# EAGLE design tinyK20 (EAGLE 6.4)
DRAWN_BY: Christian Jost; PROJECT: Infotronik; REV: 1.2; TITLE: ucBoard K20
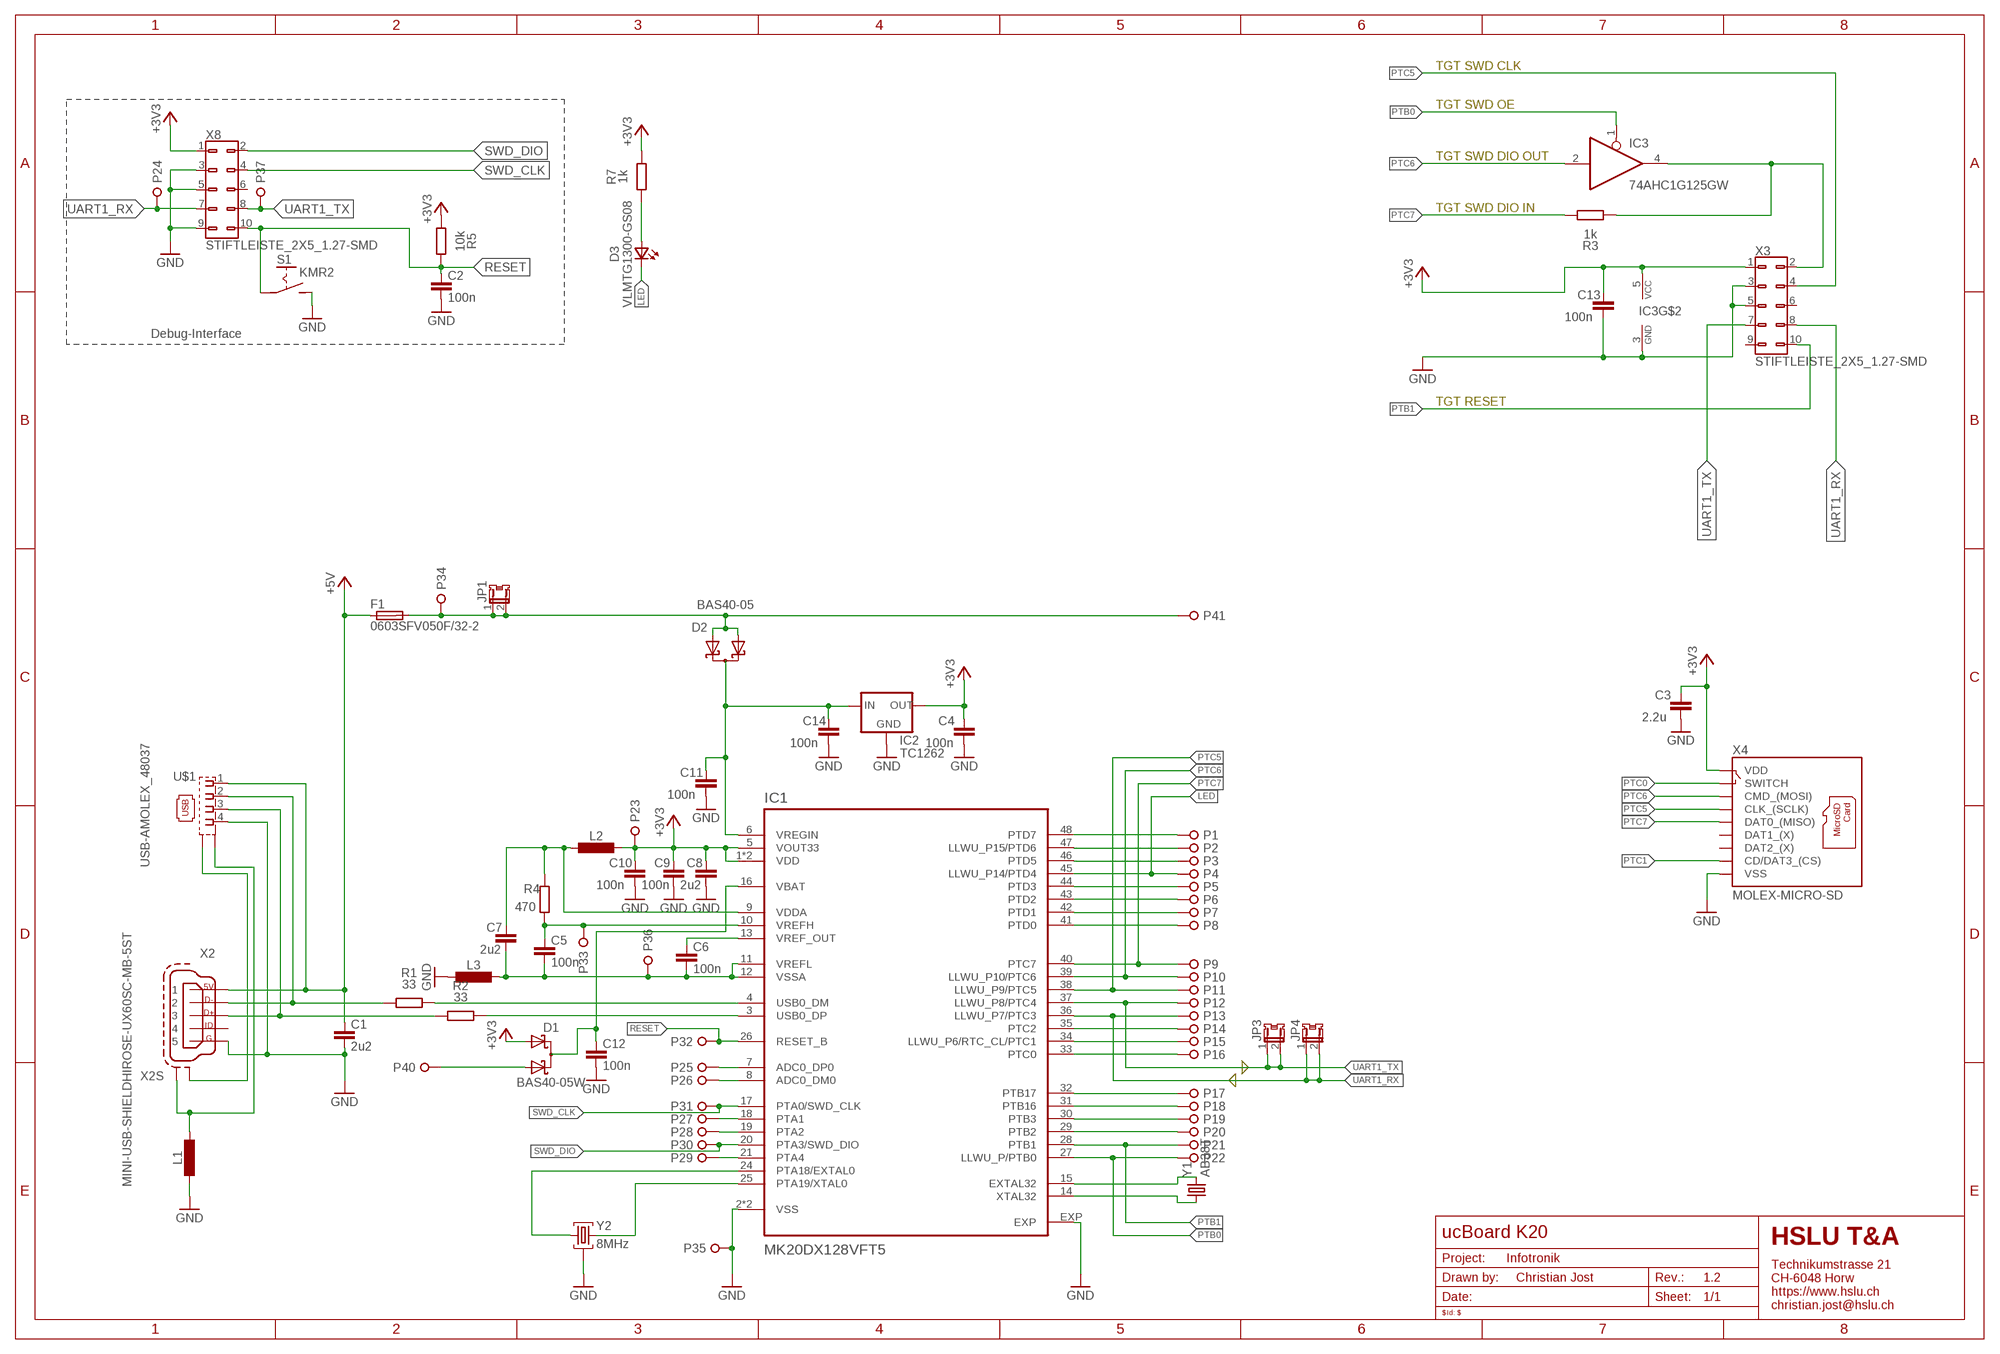
[diagram p0: schematic, sheet 1]

## Parts
C1  2u2  C0603  [C0603-R]
C2  100n  C0603  [C0603-R]
C3  2.2u  C0603  [C0603-R]
C4  100n  C0603  [C0603-R]
C5  100n  C0603  [C0603-R]
C6  100n  C0603  [C0603-R]
C7  2u2  C0603  [C0603-R]
C8  2u2  C0603  [C0603-R]
C9  100n  C0603  [C0603-R]
C10  100n  C0603  [C0603-R]
C11  100n  C0603  [C0603-R]
C12  100n  C0603  [C0603-R]
C13  100n  C0603  [C0603-R]
C14  100n  C0603  [C0603-R]
D1  BAS40-05W  [SOT-323]
D2  BAS40-05  [SOT-23]
D3  VLMTG1300-GS08  [D0603-R]
F1  0603SFV050F/32-2  [0603-R]
IC1  MK20DX128VFT5  [QFN48]
IC2  TC1262  [SOT-223]
IC3  74AHC1G125GW  [SOT-353]
JP1  JP1-SMD-1.2X1.8  [JP-SMD-1.2X1.8]
JP3  JP1-SMD-1.2X1.8  [JP-SMD-1.2X1.8]
JP4  JP1-SMD-1.2X1.8  [JP-SMD-1.2X1.8]
L1  L  [L0603-R]
L2  L  [L0603-R]
L3  L  [L0603-R]
P1  SOLDERPAD  [SOLDERPAD_TH_0.9]
P2  SOLDERPAD  [SOLDERPAD_TH_0.9]
P3  SOLDERPAD  [SOLDERPAD_TH_0.9]
P4  SOLDERPAD  [SOLDERPAD_TH_0.9]
P5  SOLDERPAD  [SOLDERPAD_TH_0.9]
P6  SOLDERPAD  [SOLDERPAD_TH_0.9]
P7  SOLDERPAD  [SOLDERPAD_TH_0.9]
P8  SOLDERPAD  [SOLDERPAD_TH_0.9]
P9  SOLDERPAD  [SOLDERPAD_TH_0.9]
P10  SOLDERPAD  [SOLDERPAD_TH_0.9]
P11  SOLDERPAD  [SOLDERPAD_TH_0.9]
P12  SOLDERPAD  [SOLDERPAD_TH_0.9]
P13  SOLDERPAD  [SOLDERPAD_TH_0.9]
P14  SOLDERPAD  [SOLDERPAD_TH_0.9]
P15  SOLDERPAD  [SOLDERPAD_TH_0.9]
P16  SOLDERPAD  [SOLDERPAD_TH_0.9]
P17  SOLDERPAD  [SOLDERPAD_TH_0.9]
P18  SOLDERPAD  [SOLDERPAD_TH_0.9]
P19  SOLDERPAD  [SOLDERPAD_TH_0.9]
P20  SOLDERPAD  [SOLDERPAD_TH_0.9]
P21  SOLDERPAD  [SOLDERPAD_TH_0.9]
P22  SOLDERPAD  [SOLDERPAD_TH_0.9]
P23  SOLDERPAD  [SOLDERPAD_TH_0.9]
P24  SOLDERPAD  [SOLDERPAD_TH_0.9]
P25  SOLDERPAD  [SOLDERPAD_TH_0.9]
P26  SOLDERPAD  [SOLDERPAD_TH_0.9]
P27  SOLDERPAD  [SOLDERPAD_TH_0.9]
P28  SOLDERPAD  [SOLDERPAD_TH_0.9]
P29  SOLDERPAD  [SOLDERPAD_TH_0.9]
P30  SOLDERPAD  [SOLDERPAD_TH_0.9]
P31  SOLDERPAD  [SOLDERPAD_TH_0.9]
P32  SOLDERPAD  [SOLDERPAD_TH_0.9]
P33  SOLDERPAD  [SOLDERPAD_TH_0.9]
P34  SOLDERPAD  [SOLDERPAD_TH_0.9]
P35  SOLDERPAD  [SOLDERPAD_TH_0.9]
P36  SOLDERPAD  [SOLDERPAD_TH_0.9]
P37  SOLDERPAD  [SOLDERPAD_TH_0.9]
P40  SOLDERPAD  [SOLDERPAD_TH_0.9]
P41  SOLDERPAD  [SOLDERPAD_TH_0.9]
R1  33  R0603  [R0603-R]
R2  33  R0603  [R0603-R]
R3  1k  R0603  [R0603-R]
R4  470  R0603  [R0603-R]
R5  10k  R0603  [R0603-R]
R7  1k  R0603  [R0603-R]
S1  KMR2  KMR211G-LFS  [SWITCH-KMR-SERIES]
U$1  USB-AMOLEX_48037  [USB-A-MOLEX_48037]
X2  MINI-USB-SHIELDHIROSE-UX60SC-MB-5ST  [USB-MINI-B-HORIZ_HIROSE-UX60SC-MB-5ST]
X3  STIFTLEISTE_2X5_1.27-SMD  [STIFTLEISTE_2X5_1.27_SMD]
X4  MOLEX-MICRO-SD  [SD-105027-001]
X8  STIFTLEISTE_2X5_1.27-SMD  [STIFTLEISTE_2X5_1.27_SMD]
Y1  AB38T  [CRYSTAL-AB38T]
Y2  8MHz  CSTCE8M00G15C  [CSTCE]

## Nets
+3V3: C3.1 C4.1 C8.1 C9.1 C10.1 C13.1 D1.1 IC1.1(VDD) IC1.5(VOUT33) IC1.22(VDD) IC2.3(OUT) IC3.5(VCC) L2.2 P23.1(PAD) R5.1 R7.2 X3.1 X4.P4(VDD) X8.1
+5V: C1.1 F1.1 U$1.1 X2.1
GND: C1.2 C2.2 C3.2 C4.2 C8.2 C9.2 C10.2 C11.2 C12.2 C13.2 C14.2 IC1.2(VSS) IC1.23(VSS) IC1.EXP IC2.2(GND) IC2.4(GND) IC3.3(GND) L1.1 L3.1 P35.1(PAD) S1.3(S) S1.4(S) U$1.4 X2.5 X3.3 X3.5 X4.P6(VSS) X8.3 X8.5 X8.9 Y2.2
LED: D3.2(K) IC1.45(LLWU_P14/PTD4) P4.1(PAD)
N$1: R1.1 U$1.2 X2.2
N$2: D1.2 P40.1(PAD)
N$3: C5.2 C6.2 C7.2 IC1.11(VREFL) IC1.12(VSSA) L3.2 P36.1(PAD)
N$4: R2.1 U$1.3 X2.3
N$5: C6.1 IC1.13(VREF_OUT)
N$6: IC1.4(USB0_DM) R1.2
N$7: C5.1 IC1.10(VREFH) P33.1(PAD) R4.1
N$8: IC1.3(USB0_DP) R2.2
N$9: IC1.24(PTA18/EXTAL0) Y2.1
N$10: IC1.25(PTA19/XTAL0) Y2.3
N$11: C7.1 IC1.9(VDDA) L2.1 R4.2
N$12: IC1.48(PTD7) P1.1(PAD)
N$13: IC1.47(LLWU_P15/PTD6) P2.1(PAD)
N$14: IC1.46(PTD5) P3.1(PAD)
N$15: U$1.S2A(S2) U$1.S2B(S2) X2.S1(S:S1)
N$16: C11.1 C14.1 D2.3 IC1.6(VREGIN) IC2.1(IN)
N$17: D3.1(A) R7.1
N$18: IC1.44(PTD3) P5.1(PAD)
N$19: C12.1 D1.3 IC1.16(VBAT)
N$20: IC1.43(PTD2) P6.1(PAD)
N$21: IC1.42(PTD1) P7.1(PAD)
N$23: IC1.41(PTD0) P8.1(PAD)
N$24: D2.1 D2.2 F1.2 JP1.1 JP1.2 P34.1(PAD) P41.1(PAD)
N$25: IC3.4(O) R3.1 X3.2
N$29: IC1.35(PTC2) P14.1(PAD)
N$32: IC1.32(PTB17) P17.1(PAD)
N$33: IC1.31(PTB16) P18.1(PAD)
N$34: IC1.30(PTB3) P19.1(PAD)
N$35: IC1.29(PTB2) P20.1(PAD)
N$38: IC1.15(EXTAL32) Y1.2
N$39: IC1.14(XTAL32) Y1.1
N$40: IC1.21(PTA4) P29.1(PAD)
N$41: IC1.19(PTA2) P28.1(PAD)
N$42: IC1.18(PTA1) P27.1(PAD)
N$43: IC1.8(ADC0_DM0) P26.1(PAD)
N$44: IC1.7(ADC0_DP0) P25.1(PAD)
N$46: L1.2 U$1.S1A(S1) U$1.S1B(S1) X2.S2(S:S2)
PTB0: IC1.27(LLWU_P/PTB0) IC3.1(OE) P22.1(PAD)
PTB1: IC1.28(PTB1) P21.1(PAD) X3.10
PTC0: IC1.33(PTC0) P16.1(PAD) X4.G1(SWITCH)
PTC1: IC1.34(LLWU_P6/RTC_CL/PTC1) P15.1(PAD) X4.P2(CD/DAT3_(CS))
PTC5: IC1.38(LLWU_P9/PTC5) P11.1(PAD) X3.4 X4.P5(CLK_(SCLK))
PTC6: IC1.39(LLWU_P10/PTC6) IC3.2(I) P10.1(PAD) X4.P3(CMD_(MOSI))
PTC7: IC1.40(PTC7) P9.1(PAD) R3.2 X4.P7(DAT0_(MISO))
RESET: C2.1 IC1.26(RESET_B) P32.1(PAD) R5.2 S1.1(C) S1.2(C) X8.10
SWD_CLK: IC1.17(PTA0/SWD_CLK) P31.1(PAD) X8.4
SWD_DIO: IC1.20(PTA3/SWD_DIO) P30.1(PAD) X8.2
UART1_RX: IC1.36(LLWU_P7/PTC3) JP4.1 JP4.2 P13.1(PAD) P24.1(PAD) X3.8 X8.7
UART1_TX: IC1.37(LLWU_P8/PTC4) JP3.1 JP3.2 P12.1(PAD) P37.1(PAD) X3.7 X8.8
Unconnected: X2.4 X3.6 X3.9 X4.P1(DAT2_(X)) X4.P8(DAT1_(X)) X8.6

## Notes on the sheet
- TGT SWD CLK
- TGT SWD OE
- TGT SWD DIO OUT
- TGT SWD DIO IN
- Debug-Interface
- TGT RESET

## Library data of the parts
C1-C14 = passive:C: Capacitor
D1 D2 = discreteSemiconductors:BAS40-05: Schottky Diode Common Cathode
D3 = discreteSemiconductors:VLM*: Vishay 0603 Highbright ChipLED VLMS1300 Super red VLMO1300 Soft orange VLMY1300 Yellow VLMG1300 Yellow green VLMTG1300 True green VLMB1300 Blue VLMB1310 Blue
F1 = misc:0603SFV*F/32-2: 0603 Very Fast-Acting Chip Fuses TE connectivity
IC1 = ICs:MK20D
IC2 = ICs:TC1262: 500mA Fixed Output CMOS LDO
IC3 = 74xx-little:74*1G125
JP1 JP3 JP4 = misc:JP1: JUMPER
L1-L3 = passive:L: Inductor
P1-P37 P40 P41 = connectors:SOLDERPAD
R1-R5 R7 = passive:R: Resistor
S1 = misc:KMR2*: SWITCH-KMR-SERIES KMR2xyz?LFS Operating Force x x=1 => 1.2 N x=2 => 2.0 N x=3 => 3.0 N x=5 => 4.0 N Contact material y y=1 => Silver y=2 => Silver long life y=3 => Gold Grounding option z z=G => Ground pin z=NG => No Ground pin
U$1 = connectors:USB-A
X2 = connectors:MINI-USB-SHIELD: MINI USB-B Conector; MFR: HIROSE; MFR_PART-NO: UX60SC-MB-5ST; MOUSER_PART-NO: 798-UX60SCMB5ST01
X3 X8 = connectors:STIFTLEISTE_2X5_1.27
X4 = connectors:MOLEX-MICRO-SD: Molex Micro-SD Card holder SD-105027-001
Y1 = discreteSemiconductors:AB?T
Y2 = discreteSemiconductors:CSTCE: muRata Ceramic Resonators CSTCE series

## Board
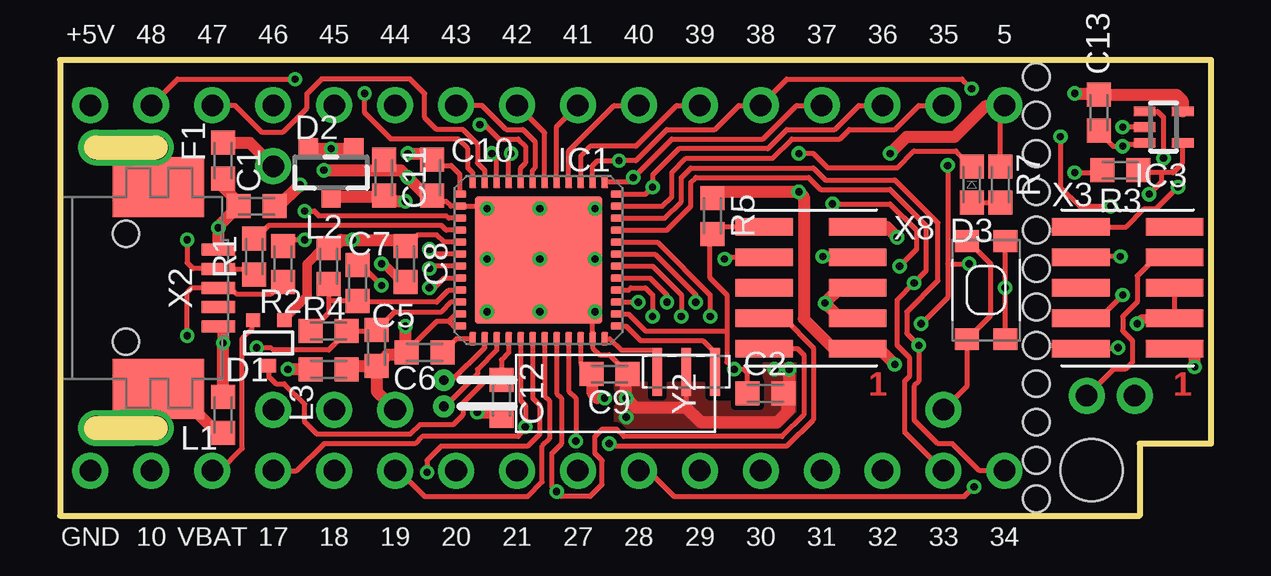
[diagram p1: board, top side]
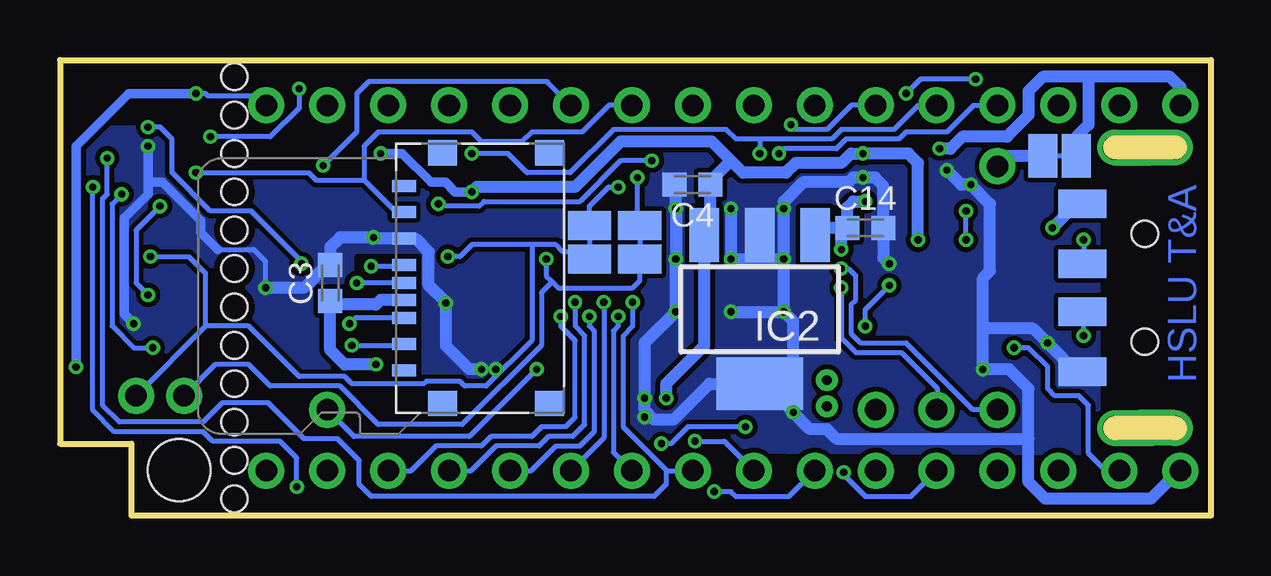
[diagram p2: board, bottom side, seen from below]

Size 47.97 x 19 mm. Coordinates in mm from the lower left corner, seen from the top.
Outline: 0,0 45,0 45,3 47.97,3 47.97,19 0,19 0,0
Copper layers (1*16): Top 0.035mm / dielectric 1.5mm / Bottom 0.035mm
Design rules "PCB-POOL Standard *": minimum track width 0.15mm, minimum drill 0.3mm, track to track 0.2mm, track to pad 0.2mm, pad to pad 0.2mm, via to via 0.2mm, smd to smd 0.15mm, copper to edge 0.3mm, drill to drill 0.2mm, minimum pad ring 0.15mm, minimum via ring 0.15mm, stop-mask expansion 0.075mm, vias tented up to drill 0.3mm, thermal gap 0.2mm
Holes 2.6 mm at 43,1.9
Holes 1.1 mm at 40.7,10.3 40.7,8.7 40.7,7.1 40.7,5.5 40.7,3.9 40.7,11.9 40.7,13.5 40.7,2.3 40.7,15.1 40.7,16.7 40.7,18.3 40.7,0.7

### Footprints (pad centres in the part's own frame; a part is rotated, then mirrored left to right if it is on the bottom)
C0603-R = smd 1 x 1: 1 -0.75,0; 2 0.75,0
SOT-323 = smd 0.6 x 0.55: 1 -0.65,-0.95; 2 0.65,-0.95; 3 0,0.95
SOT-23 = smd 0.8 x 0.9: 1 -0.95,-1; 2 0.95,-1; 3 0,1
D0603-R = smd 1 x 1: 1 -0.75,0; 2 0.75,0
0603-R = smd 1 x 1: 1 -0.75,0; 2 0.75,0
QFN48 = smd 0.55 x 0.3: 1 -3.275,2.75; 2 -3.275,2.25; 3 -3.275,1.75; 4 -3.275,1.25; 5 -3.275,0.75; 6 -3.275,0.25; 7 -3.275,-0.25; 8 -3.275,-0.75; 9 -3.275,-1.25; 10 -3.275,-1.75; 11 -3.275,-2.25; 12 -3.275,-2.75; 25 3.275,-2.75; 26 3.275,-2.25; 27 3.275,-1.75; 28 3.275,-1.25; 29 3.275,-0.75; 30 3.275,-0.25; 31 3.275,0.25; 32 3.275,0.75; 33 3.275,1.25; 34 3.275,1.75; 35 3.275,2.25; 36 3.275,2.75 | smd 0.3 x 0.55: 13 -2.75,-3.275; 14 -2.25,-3.275; 15 -1.75,-3.275; 16 -1.25,-3.275; 17 -0.75,-3.275; 18 -0.25,-3.275; 19 0.25,-3.275; 20 0.75,-3.275; 21 1.25,-3.275; 22 1.75,-3.275; 23 2.25,-3.275; 24 2.75,-3.275; 37 2.75,3.275; 38 2.25,3.275; 39 1.75,3.275; 40 1.25,3.275; 41 0.75,3.275; 42 0.25,3.275; 43 -0.25,3.275; 44 -0.75,3.275; 45 -1.25,3.275; 46 -1.75,3.275; 47 -2.25,3.275; 48 -2.75,3.275 | smd 5.309 x 5.309: EXP 0,0
SOT-223 = smd 1.219 x 2.235: 1 -2.311,-3.099; 2 0,-3.099; 3 2.311,-3.099 | smd 3.6 x 2.2: 4 0,3.099
SOT-353 = smd 0.4 x 0.9: 1 -0.65,-0.8; 2 0,-0.8; 3 0.65,-0.8; 4 0.65,0.8; 5 -0.65,0.8
JP-SMD-1.2X1.8 = smd 1.2 x 1.8: 1 -0.7,0; 2 0.7,0
L0603-R = smd 1 x 1: 1 -0.75,0; 2 0.75,0
SOLDERPAD_TH_0.9 = drill 0.9 pad 1.5: 1 0,0
R0603-R = smd 1 x 1: 1 -0.75,0; 2 0.75,0
SWITCH-KMR-SERIES = smd 0.9 x 1: 1 -2.05,-0.8; 2 2.05,-0.8; 3 2.05,0.8; 4 -2.05,0.8
USB-A-MOLEX_48037 = smd 1.2 x 2: 1 3.5,5.35; 2 1,5.35; 3 -1,5.35; 4 -3.5,5.35 | drill 1 offset: S1A -5.85,4; S1B -5.85,1.5; S2A 5.85,4; S2B 5.85,1.5 | hole 1.1: -2.25,2.75; 2.25,2.75
USB-MINI-B-HORIZ_HIROSE-UX60SC-MB-5ST = smd 0.5 x 1.4: 1 -1.6,6.1; 2 -0.8,6.1; 3 0,6.1; 4 0.8,6.1; 5 1.6,6.1 | smd 2.5 x 3.8: S1 -4.2,3.6; S2 4.2,3.6
STIFTLEISTE_2X5_1.27_SMD = smd 0.74 x 2.4: 1 -2.54,-1.95; 2 -2.54,1.95; 3 -1.27,-1.95; 4 -1.27,1.95; 5 0,-1.95; 6 0,1.95; 7 1.27,-1.95; 8 1.27,1.95; 9 2.54,-1.95; 10 2.54,1.95
SD-105027-001 = smd 1.05 x 1.2: C1 -5.225,-2.32; C2 5.225,-2.32; C3 5.225,2.13; C4 -5.225,2.13 | smd 0.5 x 1: G1 0.2,-3.93; P1 3.85,-3.93; P2 2.75,-3.93; P3 1.65,-3.93; P4 0.9,-3.93; P5 -0.55,-3.93; P6 -1.65,-3.93; P7 -2.75,-3.93; P8 -3.85,-3.93
CRYSTAL-AB38T = drill 0.4 pad 0.9: 1 -0.55,0; 2 0.55,0
CSTCE = smd 0.4 x 2: 1 -1.2,0; 2 0,0; 3 1.2,0

### Placement (x,y rotation side)
C1  8.2,12.9 0 top
C2  29.4,5.1 0 top
C3  36.7,9.7 90 bottom
C4  21.6,13.8 180 bottom
C5  13.2,7 270 top
C6  15.2,6.8 180 top
C7  12.4,9.7 90 top
C8  14.4,10.5 270 top
C9  22.9,5.9 0 top
C10  15.5,14.1 270 top
C11  13.5,14.1 90 top
C12  18.4,4.9 270 top
C13  43.3,16.8 270 top
C14  14.4,12 0 bottom
D1  8.7,7.2 180 top
D2  11.3,14.3 180 top
D3  38,13.8 90 top
F1  6.8,14.8 90 top
IC1  19.95,10.65 0 top
IC2  18.8,8.6 180 bottom
IC3  46,16.2 270 top
JP1  6.3,15 0 bottom
JP3  23.8,11.4 270 bottom
JP4  25.9,11.4 270 bottom
L1  6.8,4.2 270 top
L2  11.2,10.4 90 top
L3  11.2,6.1 0 top
P1  3.81,17.11 0 top
P2  6.35,17.11 0 top
P3  8.89,17.11 0 top
P4  11.43,17.11 0 top
P5  13.97,17.11 0 top
P6  16.51,17.11 0 top
P7  19.05,17.11 0 top
P8  21.59,17.11 0 top
P9  24.13,17.11 0 top
P10  26.67,17.11 0 top
P11  29.21,17.11 0 top
P12  31.75,17.11 0 top
P13  34.29,17.11 270 top
P14  36.83,17.11 270 top
P15  39.37,1.87 270 top
P16  36.83,1.87 270 top
P17  34.29,1.87 270 top
P18  31.75,1.87 270 top
P19  29.21,1.87 270 top
P20  26.67,1.87 270 top
P21  24.13,1.87 270 top
P22  21.59,1.87 0 top
P23  39.37,17.11 0 top
P24  44.8,5 0 top
P25  8.89,4.41 0 top
P26  11.43,4.41 0 top
P27  11.43,1.87 0 top
P28  13.97,1.87 0 top
P29  19.05,1.87 0 top
P30  16.51,1.87 0 top
P31  8.89,1.87 0 top
P32  36.83,4.41 0 top
P33  3.81,1.87 0 top
P34  8.89,14.57 0 top
P35  1.27,1.87 0 top
P36  13.97,4.41 0 top
P37  42.8,5 0 top
P40  6.35,1.87 0 top
P41  1.27,17.11 0 top
R1  8.1,10.8 90 top
R2  9.3,10.5 90 top
R3  44.2,14.4 180 top
R4  11.2,7.7 180 top
R5  27.2,12.5 270 top
R7  39.2,13.8 90 top
S1  38.6,9.4 270 top
U$1  0,9.5 90 bottom
X2  0.51,9.49 270 top
X3  44.5,9.5 90 top
X4  29.7,9.9 270 bottom
X8  31.3,9.5 90 top
Y1  16,5.1 270 top
Y2  26.1,6 0 top

### Tracks (layer width: path | path; a pad name or v marks a point on that pad's centre or on a via)
+3V3  (via drill 0.3)
  Top 0.2: 16.7,13.43 IC1.1 16.68,14.22 16.3,14.6 15.5,14.6 C10.1 | IC1.5 16,11.4 15.7,11.7 14.9,11.7 14.7,11.5 14.65,11.5 C8.1 | 39.37,17.07 P23.1 | R7.2 39.2,16.97 39.3,17.07 | IC1.22 21.7,6.35 C9.1
  Top 0.4: 10.95,11.15 10.3,10.5 10.3,9.15 9.35,8.2 D1.1
  Top 0.5: 39.37,17.07 39.3,17.07 38.57,17.07 37.3,15.8 35.3,15.8 v34.6,15.1 | L2.2 11.15,11.15 | L2.2 11.35,11.15 11.7,11.5 v12.2,11.5 14.15,11.5 C8.1 | L2.2 10.95,11.15 | v22.7,4.9 22.4,4.9 22.2,5.1 22.2,5.85 C9.1 | R5.1 27.45,13.5 v30.8,13.5 31,13.3 31,8.2 32.24,6.96 X8.1 34.14,6.96 v34.8,6.3 | IC3.5 46.8,17.3 46.55,17.55 C13.1 43.25,17.6 v42.3,17.6 | v47.3,6.2 47.3,7 46.49,7 X3.1 | v14.5,15.1 15.25,15.1 C10.1
  Bottom 0.2: P23.1 39.61,17.11 40,17.5 41.8,17.5 41.9,17.6 v42.3,17.6
  Bottom 0.4: v34.6,15.1 33.7,15.1 32.5,13.9 31.9,13.9 31.5,13.5 v30.8,13.5 | v42.3,17.6 45.1,17.6 47.3,15.4 v47.3,6.2
  Bottom 0.5: v12.2,11.5 12.2,14.7 12.6,15.1 v14.5,15.1 15,15.1 15.4,14.7 17.3,14.7 17.7,14.3 19.5,14.3 20,14.8 | 20,14.8 20.8,15.6 24.6,15.6 26.5,13.7 30.6,13.7 v30.8,13.5 | v22.7,4.9 22.7,5.5 21.11,7.09 IC2.3 20.85,11.96 C4.1 20.85,13.95 20,14.8 | X4.P4 34.6,9 34.8,8.8 36.55,8.8 36.62,8.88 | 36.62,8.88 C3.1 | v34.8,6.3 36.1,6.3 36.7,6.9 36.7,8.8 36.62,8.88
+5V  (via drill 0.3)
  Top 0.5: X2.1 v6.61,11.99 v6.6,12 6.6,12.05 C1.1 7.45,13.05 6.7,13.8 6.7,13.95 F1.1
  Bottom 0.5: U$1.1 5.6,13 v6.6,12
GND  (via drill 0.3)
  Top 0.2: v17.8,12.8 17.7,12.9 IC1.2 16.3,12.9 16.1,13.1 15.65,13.1 | 18.25,4.3 C12.2 | Y2.2 26.1,4.5 | S1.3 v39.4,9.5 S1.4 | X3.5 X3.3 46.42,8.2 | C13.2 43.3,16 43.9,15.4 v44.3,15.4 44.4,15.4 44.5,15.5 45.15,15.5 IC3.3 | 23.7,5.8 23.7,5.9 22.9,6.7 22.5,6.7 22.2,7 IC1.23 22.2,8.4 v22.3,8.5 | C2.2 30.15,4.15 29.9,3.9
  Top 0.4: v13.4,10.5 13.5,10.5 14,10 14.15,10 C8.2 | 46.42,8.2 45.1,8.2 v44.9,8
  Top 0.5: v17.4,4.3 18.25,4.3 | L3.1 v9.5,6.1 | L1.1 v6.8,7.2 6.8,7.8 6.71,7.89 X2.5 | C1.2 9.1,12.9 v10,13.8 | v20,10.7 IC1.EXP | C9.2 23.6,5.85 v23.6,4.9 24,4.5 26.1,4.5 26.7,3.9 29.9,3.9 30.4,4.4 v30.4,6.1 | X8.9 34.46,12.04 v34.9,11.6 | X8.5 32.53,9.5 v31.89,8.86 32.52,8.23 X8.3 | 15.25,13.35 C10.2 15.65,13.2 15.65,13.1 | v11,14.4 13.5,14.4 | 13.5,14.4 C11.2 | 13.5,14.4 14.2,14.4 15.3,13.3 15.5,13.3
  Bottom 0.2: v39.4,9.5 39.4,10.6 39.9,11.1 41.4,11.1
  Bottom 0.4: v44.3,15.4 44.3,13.9 | v44.9,8 45.3,8.4 45.3,12.4 44.3,13.4 44.3,13.9 | 44.3,13.9 43.7,13.9 42.1,12.3 42.1,11.8 41.4,11.1
  Bottom 0.5: v17.4,4.3 16.7,3.6 16,3.6 15.6,3.2 7.6,3.2 | v17.8,8.5 v17.8,10.7 | v17.8,10.7 v17.8,12.8 17.8,13.1 17,13.9 15.1,13.9 14.9,14.1 14,14.1 13.65,13.75 C14.2 13.65,10.75 v13.4,10.5 | P35.1 1.33,1.87 2.5,0.7 6.9,0.7 7.6,1.4 7.6,3.2 | 9.5,7.9 v9.5,6.1 8.4,6.1 7.6,5.3 7.6,3.2 | 9.5,7.9 9.5,9.9 9.2,10.2 9.2,13 v10,13.8 10.4,13.8 v11,14.4 | 9.5,7.9 9.4,7.8 7.4,7.8 v6.8,7.2 5.6,6 U$1.4 | v20,8.5 v17.8,8.5 | 18.8,10.7 v20,10.7 v20,12.8 | 18.8,10.7 v17.8,10.7 | v17.4,4.3 17.4,8.1 v17.8,8.5 | v34.9,11.6 35,11.6 | 35,11.6 36.3,11.6 36.7,11.2 C3.2 36.85,10.45 37.8,9.5 v39.4,9.5 | 35,11.6 34.95,11.55 X4.P6 33.15,11.55 32.6,11 32.6,9.6 31.9,8.9 v31.9,8.87 v31.89,8.86 31.89,7.09 30.9,6.1 v30.4,6.1 | IC2.2 18.8,10.7 | v17.4,4.3 18.6,5.5 IC2.4 20.9,5.5 22.4,4 23.2,4 23.6,4.4 v23.6,4.9 23.6,7.2 v22.3,8.5 v22.3,10.7 v22.3,12.8 22.3,13.75 C4.2
  other vias: 14.5,14.1 29.8,6.1 23.6,4.1
  pour Bottom (no thermals): 4.7,2.6 48,2.8 48,16.2 4.7,16
  pour Top (no thermals): 23.2,5.5 26.8,5.5 27.6,4.7 29.4,4.7 29.4,6.4 31,6.4 31,3.5 23.2,3.5
LED  (via drill 0.3)
  Top 0.2: IC1.45 18.7,15 v18.8,15.1 | 37.95,14.6 D3.2 37.35,15.2 35.6,15.2 34.9,14.5 32,14.5 31.4,15.1 v30.8,15.1
  Bottom 0.2: P4.1 12.19,17.11 13.2,16.1 15.4,16.1 15.8,15.7 18.8,15.7 | 18.8,15.7 v18.8,15.1 | 18.8,15.7 19.8,15.7 20.2,16.1 24.9,16.1 26.7,14.3 28.5,14.3 29.3,15.1 v30.8,15.1
N$1  (via drill 0.3)
  Top 0.2: R1.1 7.86,10.29 X2.2 6.6,10.3 5.55,10.3 5.3,10.55 v5.3,11.5
  Bottom 0.2: v5.3,11.5 5.3,10.55 U$1.2
N$2
  Top 0.2: P40.1 6.67,1.87 7.6,2.8 7.6,7.4 8,7.8 8,8.1 D1.2
N$3  (via drill 0.3)
  Top 0.2: IC1.11 16.5,8.4 16.2,8.1 | IC1.12 16.4,7.9 16.2,8.1 | 14.4,6.85 C6.2 14.45,6.85 15.7,8.1 16.2,8.1 | C7.2 12.55,10.45 v13.4,9.6
  Top 0.5: L3.2 11.8,6.25 C5.2 | C5.2 13.65,6.7 14.3,6.7 14.4,6.8 14.4,6.85 v14.4,7.9 | C5.2 13.2,5.18 P36.1
  Bottom 0.2: v14.4,7.9 14.4,8.6 v13.4,9.6
N$4  (via drill 0.3)
  Top 0.2: 6.6,9.5 X2.3 | X2.3 5.49,9.49 5.3,9.3 v5.3,7.5 | X2.3 7.11,9.49 7.35,9.25 8.8,9.25 R2.1
  Bottom 0.2: v5.3,7.5 5.3,8.45 U$1.3
N$5
  Top 0.2: IC1.13 16.52,7.38 C6.1
N$6
  Top 0.2: IC1.4 16.1,11.9 15.9,12.1 8.7,12.1 8.15,11.55 R1.2
N$7  (via drill 0.3)
  Top 0.2: IC1.10 16.3,8.9 15.9,8.5 13.95,8.5 C5.1 13.15,7.7 R4.1 11.95,7.65 11.2,6.9 8.9,6.9 8.8,7 v8.2,7
  Bottom 0.2: P33.1 4.37,1.87 5.1,2.6 5.1,4.6 5.5,5 6.5,5 6.8,5.3 6.8,6.2 7.6,7 v8.2,7
N$8  (via drill 0.3)
  Top 0.2: IC1.3 16.2,12.4 16.1,12.5 10.8,12.5 10.6,12.7 v10.2,12.7 | v10.2,11.5 9.55,11.5 R2.2
  Bottom 0.2: v10.2,11.5 v10.2,12.7
N$9
  Top 0.2: IC1.24 22.93,7.38 23.4,6.9 24.8,6.9 24.9,6.8 Y2.1
N$10
  Top 0.2: Y2.3 27.3,6.8 26.8,7.3 24.2,7.3 23.6,7.9 IC1.25
N$11
  Top 0.2: IC1.9 16.2,9.4 15.7,8.9 12.45,8.9 C7.1 11.25,8.95 11.2,8.9 | L2.1 11.2,8.9 | 11.2,8.9 11.2,8.45 R4.2
N$12  (via drill 0.3)
  Top 0.2: IC1.48 17.2,14.3 17,14.5 17,15.3 16.6,15.7 13.8,15.7 12.7,16.8 v12.7,17.6 | P1.1 4.9,18.2 v9.8,18.2
  Bottom 0.2: v9.8,18.2 12.1,18.2 v12.7,17.6
N$13
  Top 0.2: IC1.47 17.7,14.4 17.4,14.7 17.4,15.5 16.8,16.1 15.7,16.1 15.2,16.6 15.2,17.6 14.6,18.2 10.9,18.2 10.3,17.6 10.3,17 9.3,16 8.4,16 7.29,17.11 P2.1
N$14  (via drill 0.3)
  Top 0.2: IC1.46 18.2,14.9 v18,15.1
  Bottom 0.2: P3.1 9.9,17.1 11,16 12.7,16 13,15.7 15.2,15.7 15.6,15.3 17.8,15.3 v18,15.1
N$15
  Top 0.5: U$1.S2B U$1.S2A 4,13.8 X2.S1
N$16  (via drill 0.3)
  Top 0.2: IC1.6 15.6,10.9 v15.4,11.1
  Top 0.5: D2.3 13.45,13.3 C11.1 13.75,13.1 v14.4,13.1
  Bottom 0.5: C14.1 15.15,12.85 14.9,13.1 v14.4,13.1 | v15.4,11.1 15.4,11.75 C14.1 | C14.1 16.19,12 IC2.1
N$17
  Top 0.2: D3.1 R7.1
N$18  (via drill 0.3)
  Top 0.2: IC1.44 19.2,14.5 19.4,14.7 19.4,15.4 19.1,15.7 18.3,15.7 17.7,16.3 v17.5,16.3
  Bottom 0.2: P5.1 14.99,17.11 16,16.1 17.3,16.1 v17.5,16.3
N$19
  Top 0.2: IC1.16 18.7,6.8 18.4,6.5 C12.1 17.75,5.65 16.8,4.7 16.8,4.2 16.4,3.8 15,3.8 14.6,3.4 10.7,3.4 10.2,3.9 10.2,4.65 9.35,5.5 9,5.5 8.7,5.8 D1.3
N$20
  Top 0.2: P6.1 17.6,17.1 18.6,16.1 19.3,16.1 19.8,15.6 19.8,14.5 19.7,14.4 IC1.43
N$21
  Top 0.2: 19.3,16.86 P7.1 20.2,15.96 IC1.42
N$23
  Top 0.2: IC1.41 20.7,16.22 P8.1
N$24  (via drill 0.3)
  Top 0.5: F1.2 7.91,15.55 P34.1 | D2.1 v11.3,15.3 D2.2
  Bottom 0.2: JP1.2 JP1.1
  Bottom 0.5: JP1.1 8.46,15 P34.1 | P41.1 1.27,17.87 1.7,18.3 5.1,18.3 | 5.1,18.3 5.1,16.3 5.6,15.8 JP1.2 | 5.1,18.3 7,18.3 7.6,17.7 7.6,16.7 8.5,15.8 10.35,15.8 10.85,15.3 v11.3,15.3
N$25  (via drill 0.3)
  Top 0.2: 45.9,14.3 46.4,14.3 46.8,14.7 IC3.4 | 45.9,14.3 45.05,14.3 R3.1 | 45.9,14.3 45.9,13.9 v45.4,13.4 | X3.2 44.06,6.96 v44.1,7
  Bottom 0.2: v45.4,13.4 45.8,13 45.8,7.9 44.9,7 v44.1,7
N$26
  cutout Bottom: 33,10.8 35.6,10.8 35.6,5.8 33,5.8
N$29
  Top 0.2: P14.1 35.8,17.1 34.8,16.1 32.9,16.1 32.5,15.7 30.5,15.7 29.7,14.9 26.1,14.9 25.5,14.3 25.5,13.3 25.1,12.9 IC1.35
N$32  (via drill 0.3)
  Top 0.2: IC1.32 24.9,11.4 27.1,9.2 v27.1,8.3
  Bottom 0.2: v27.1,8.3 27.1,7.9 26.5,7.3 26.5,4.1 26.9,3.7 27.9,3.7 28.3,3.3 30,3.3 30.4,2.9 32.3,2.9 33.33,1.87 P17.1
N$33  (via drill 0.3)
  Top 0.2: IC1.31 24.8,10.9 26.5,9.2 v26.5,8.9
  Bottom 0.2: v26.5,8.9 26.5,7.9 26.1,7.5 26.1,3.8 26.6,3.3 27.6,3.3 28,2.9 29.8,2.9 30.83,1.87 P18.1
N$34  (via drill 0.3)
  Top 0.2: IC1.30 24.7,10.4 25.9,9.2 v25.9,8.3
  Bottom 0.2: P19.1 28.33,1.87 27.3,2.9 26.3,2.9 25.75,3.45 25.7,3.5 25.7,7.7 25.9,7.9 v25.9,8.3
N$35  (via drill 0.3)
  Top 0.2: IC1.29 24.6,9.9 25.3,9.2 v25.3,8.9
  Bottom 0.2: v25.3,8.9 25.3,3.24 P20.1
N$38
  Top 0.2: Y1.2 16.05,4.55 17.4,5.9 17.4,6.1 18.2,6.9 IC1.15
N$39
  Top 0.2: Y1.1 16.35,5.65 17.7,7 IC1.14
N$40  (via drill 0.3)
  Top 0.2: IC1.21 21.2,5.2 21.5,4.9 v21.5,3.1
  Bottom 0.2: v21.5,3.1 20.28,3.1 P29.1
N$41
  Top 0.2: P28.1 14.13,1.87 15.2,0.8 19.5,0.8 20.1,1.4 20.1,2.9 20.4,3.2 20.4,4.8 20.2,5 IC1.19
N$42  (via drill 0.3)
  Top 0.2: IC1.18 19.7,4.9 20,4.6 20,3.4 19.5,2.9 15.9,2.9 15.3,2.3 v15.3,1.8
  Bottom 0.2: v15.3,1.8 15.3,1.7 14.4,0.8 12.5,0.8 P27.1
N$43  (via drill 0.3)
  Top 0.2: v15.4,9.5 15.6,9.5 16,9.9 IC1.8
  Bottom 0.2: v15.4,9.5 15.4,7.4 14.8,6.8 12.9,6.8 11.4,5.3 11.4,4.44 P26.1
N$44  (via drill 0.3)
  Top 0.2: IC1.7 15.5,10.4 v15.4,10.3
  Bottom 0.2: v15.4,10.3 15.1,10.3 14.8,10 14.8,9 15,8.8 15,7.6 14.6,7.2 12.7,7.2 9.91,4.41 P25.1
N$46
  Top 0.2: U$1.S1B U$1.S1A
  Top 0.5: U$1.S1A 4,4.7 | 4,4.7 4,5.18 X2.S2 | L1.2 6.55,3.45 5.3,4.7 4,4.7
PTB0  (via drill 0.3)
  Top 0.2: IC1.27 v24.1,8.9 | v46,14.9 46,16.6 45.75,16.85 IC3.1
  Bottom 0.2: v24.1,8.9 24.1,7.9 24.5,7.5 24.5,3.7 22.7,1.9 | 22.7,1.9 22.67,1.87 P22.1 | 22.7,1.9 22.7,1.3 23.2,0.8 35,0.8 35.5,1.3 35.5,2.3 36.4,3.2 37.8,3.2 39.3,4.7 41.2,4.7 42,3.9 45.5,3.9 46.2,4.6 46.2,13.2 46,13.4 v46,14.9
PTB1  (via drill 0.3)
  Top 0.2: IC1.28 23.7,9.4 23.8,9.5 24.4,9.5 24.7,9.2 v24.7,8.3 | P21.1 24.53,1.87 25.6,0.8 37.7,0.8 v38.1,1.2 | X3.10 44.44,12.04 45.2,12.8 45.7,12.8 v46.6,13.7
  Bottom 0.2: P21.1 24.9,2.64 24.9,7.7 24.7,7.9 v24.7,8.3 | v38.1,1.2 38.1,2.4 38.8,3.1 41.6,3.1 42,3.5 45.7,3.5 46.6,4.4 v46.6,13.7
PTC0  (via drill 0.3)
  Top 0.2: P16.1 35.2,3.5 35.2,5.6 35.4,5.8 35.4,6.6 34.9,7.1 34.9,9 v35.6,9.7 36.1,10.2 36.1,12.1 34.6,13.6 31.7,13.6 31.2,14.1 26.5,14.1 26.3,13.9 26.3,12.9 25.3,11.9 IC1.33
  Bottom 0.2: X4.G1 v35.6,9.7
PTC1  (via drill 0.3)
  Top 0.2: P15.1 38.33,1.87 37.2,3 36.6,3 35.6,4 35.6,5.4 35.8,5.6 v35.8,7.1 35.3,7.6 35.3,8.5 36.6,9.8 36.6,12.2 34.8,14 31.9,14 31.4,14.5 26.3,14.5 25.9,14.1 25.9,13.1 25.2,12.4 IC1.34
  Bottom 0.2: v35.8,7.1 33.68,7.1 X4.P2
PTC5  (via drill 0.3)
  Top 0.2: v32.2,13 34.6,13 35.7,11.9 35.7,11.1 v35,10.4 | v38,17.8 37.6,18.2 30.3,18.2 P11.1 28.3,17.1 27.3,16.1 25.3,16.1 24,14.8 v23.3,14.8 22.4,14.8 22.2,14.6 IC1.38 | X3.4 42.62,8.3 43.5,8.3 43.5,8.4 v44.3,9.2 | v41.7,15.8 41.7,13.7 42.5,12.9 v43.8,12.9
  Bottom 0.2: v41.7,15.8 39.2,15.8 38,17 v38,17.8 | v23.3,14.8 24.6,14.8 26.3,13.1 30.3,13.1 30.5,12.9 32.1,12.9 v32.2,13 | v35,10.4 33.68,10.4 X4.P5 | v43.8,12.9 44.8,11.9 44.8,9.7 v44.3,9.2
PTC6  (via drill 0.3)
  Top 0.2: P10.1 25.7,17.1 24,15.4 22.1,15.4 21.7,15 IC1.39 | IC3.2 v44.3,16.2 | v37,14.6 37,10.5 | 37,10.5 37,9.1 v35.9,8 | 37,10.5 v37.9,10.5
  Bottom 0.2: v37,14.6 35.6,16 35.6,17.6 35.1,18.1 27.66,18.1 P10.1 | v44.3,16.2 43.8,16.2 43.3,15.7 43.3,14.3 41.7,12.7 40,12.7 37.9,10.6 v37.9,10.5 | 35.85,7.95 v35.9,8 35.65,8.25 X4.P3
PTC7  (via drill 0.3)
  Top 0.2: IC1.40 21.2,15.2 23.1,17.1 P9.1 | v42.3,14.3 43.35,14.3 R3.2
  Bottom 0.2: v42.3,14.3 37.6,14.3 37.3,14 35.3,14 | P9.1 25.09,17.11 26.2,16 28.3,16 28.7,15.6 30.4,15.6 30.8,16 34.7,16 35.3,15.4 35.3,14 | X4.P7 33.95,12.65 35.3,14
RESET  (via drill 0.3)
  Top 0.2: IC1.26 23.7,8.4 24.4,7.7 27.8,7.7 | P32.1 37.8,5.38 S1.2 38.8,8.35 38.8,10.5 37.85,11.45 S1.1 | X8.10 27.49,12.04 R5.2 27.1,11.65 27.1,9.9 27.8,9.2 27.8,7.7 | 27.8,7.7 27.8,6.4 v28.1,6.1 28.5,6.1 28.65,5.95 C2.1
  Bottom 0.2: P32.1 35.72,3.3 30.9,3.3 v28.1,6.1
SWD_CLK  (via drill 0.3)
  Top 0.2: P31.1 9.87,1.87 11,3 14.8,3 15.1,3.3 19.1,3.3 19.4,3.6 v19.4,3.7 19.4,4.6 19.2,4.8 IC1.17 | X8.4 30.17,8.23 31.4,7 31.4,4 30.3,2.9 23,2.9 v22.9,3
  Bottom 0.2: v19.4,3.7 21.8,3.7 22.5,3 v22.9,3
SWD_DIO  (via drill 0.3)
  Top 0.2: X8.2 30.74,6.96 31,6.7 31,4.2 30.1,3.3 23.5,3.3 23.2,3.6 22.6,3.6 22.3,3.3 22.3,2.6 22.6,2.3 22.6,1.3 22.1,0.8 20.9,0.8 v20.7,1 20.5,1.2 20.5,2.6 20.9,3 20.9,4.9 20.7,5.1 IC1.20
  Bottom 0.2: P30.1 17.58,0.8 19.8,0.8 20,1 v20.7,1
UART1_RX  (via drill 0.3)
  Top 0.2: v44.2,10.8 42.58,10.8 X3.8 | P13.1 33.3,17.1 32.3,16.1 30.3,16.1 29.5,15.3 25.8,15.3 24.7,14.2 v24.7,13.7 24.4,13.4 IC1.36 | X8.7 31.83,10.77 v31.8,10.8
  Bottom 0.2: JP4.2 25.9,10.9 | 25.9,10.9 26,11 27,11 27.3,11.3 28.3,11.3 | 28.3,11.3 30.8,11.3 31.3,10.8 v31.8,10.8 | 28.3,11.3 28.3,7.3 30.2,5.4 31.1,5.4 31.3,5.6 32.7,5.6 32.8,5.5 35.8,5.5 36.1,5.8 38,5.8 40.1,7.9 41.9,7.9 | 41.9,7.9 P24.1 | 41.9,7.9 41.9,10.1 42.6,10.8 v44.2,10.8 | v24.7,13.7 25.1,13.7 25.9,12.9 JP4.1 25.9,10.9
UART1_TX  (via drill 0.3)
  Top 0.2: X8.8 27.77,10.77 v27.7,10.7 | P37.1 43.9,6.1 44.4,6.1 44.7,6.4 44.7,7.3 44.3,7.7 44.3,8.3 44.9,8.9 44.9,10 45.67,10.77 X3.7 | P12.1 30.7,17.1 29.3,15.7 25.5,15.7 v23.9,14.1 23.73,13.93 IC1.37
  Bottom 0.2: v27.7,10.7 27.7,10 27.5,9.8 | 27.5,9.8 27.2,9.5 24.1,9.5 23.8,9.8 JP3.2 JP3.1 23.9,12.1 v23.9,14.1 | 27.5,9.8 27.5,9.7 27.9,9.3 27.9,7.1 31.2,3.8 34.7,3.8 36.3,5.4 39.2,5.4 40.1,6.3 41.5,6.3 P37.1

### Text on the board
Top: 1 | 1
Bottom: HSLU T&A
tNames: +5V USB | !Reset | +5V | 48 | 47 | 46 | 45 | 44 | 43 | 42 | 41 | 40 | 39 | 38 | 37 | 36 | 35 | 5 | GND | 10 | VBAT | 17 | 18 | 19 | 20 | 21 | 27 | 28 | 29 | 30 | 31 | 32 | 33 | 34 | ADC0_DP0 | ADC0_DM0 | VREF-Low